# Altium schematic sheet [05] - BOTOES_LEDS.SchDoc
size A4; DocumentNumber: 5; SheetNumber: 5; SheetTotal: 5; Folha: Botões e LED's
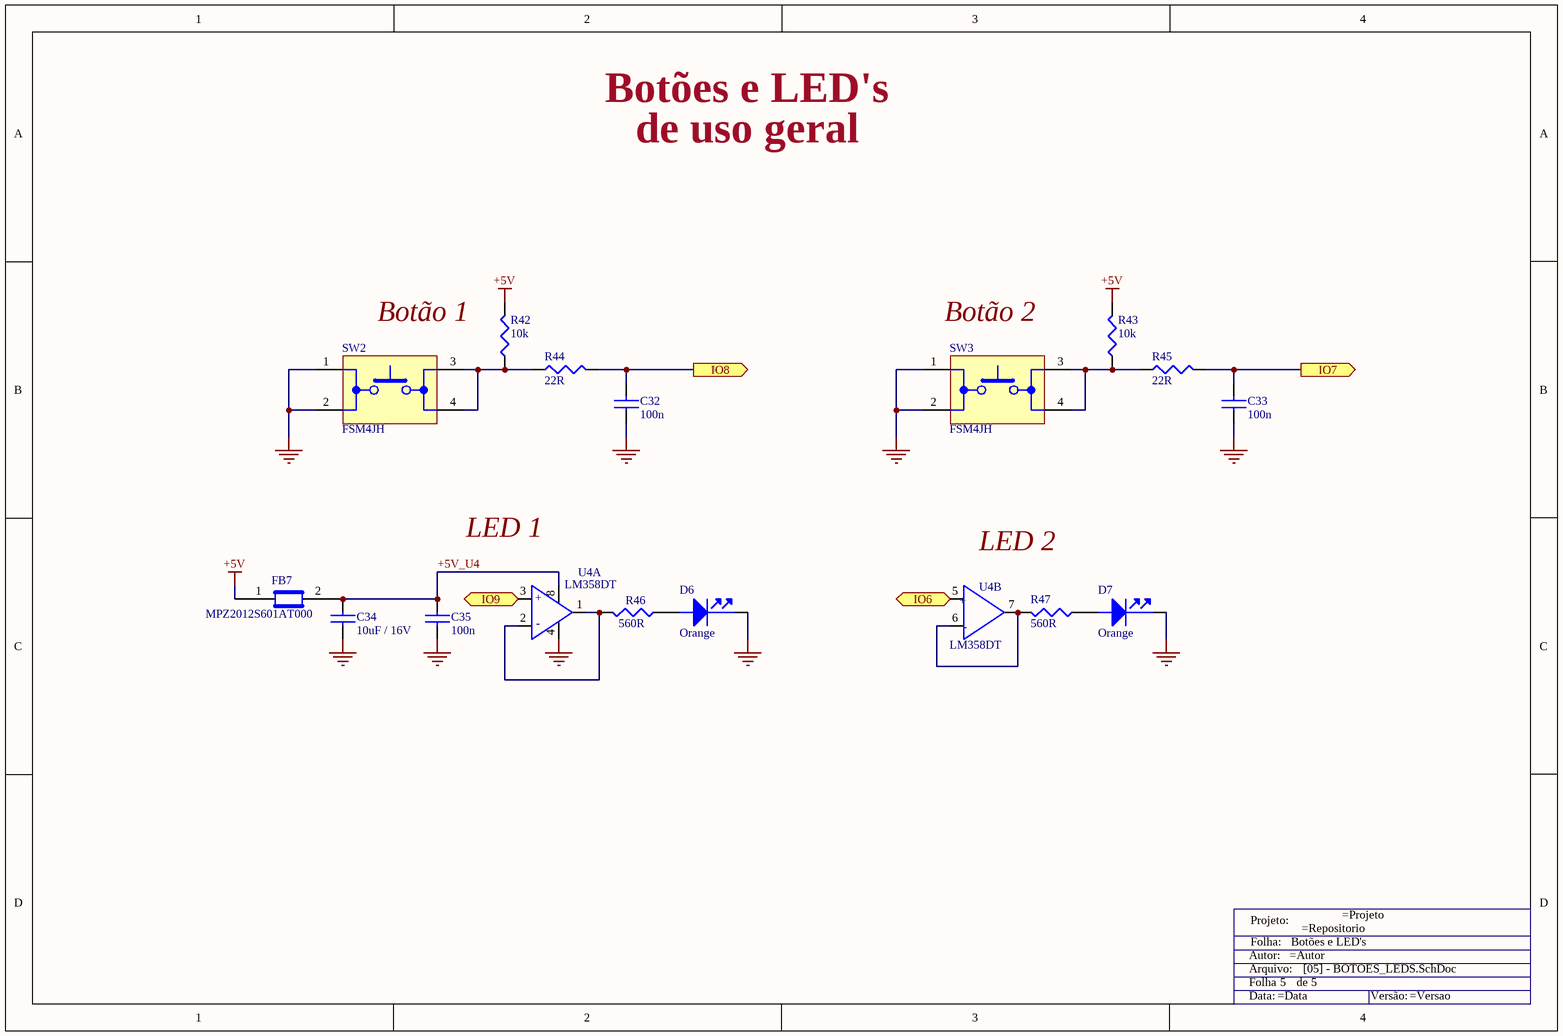
[diagram p0: [05] - BOTOES_LEDS.SchDoc]

## Parts
C32  100n  [C0805]
C33  100n  [C0805]
C34  10uF / 16V  [C0805]
C35  100n  [C0805]
D6  Orange  [LED_0603]
D7  Orange  [LED_0603]
FB7  MPZ2012S601AT000  [C0805]
R42  10k  [R0805]
R43  10k  [R0805]
R44  22R  [R0805]
R45  22R  [R0805]
R46  560R  [R0805]
R47  560R  [R0805]
SW2  FSM4JH  [FSM4JH]
SW3  FSM4JH  [FSM4JH]
TitleBlock5  Title Block  (value not drawn)  (graphical)
U4  LM358DT  [SO-8]  (parts A,B of 2)

## Ports
IO6 (in), IO7 (out), IO8 (out), IO9 (in)

## Nets
+5V: FB7.1 R42.2 R43.2
GND: C32.1 C33.1 C34.2 C35.2 D6.1(Cathode) D7.1(Cathode) SW2.1 SW2.2 SW3.1 SW3.2 U4.4(GND)
+5V_U4: C34.1 C35.1 FB7.2 U4.8(VCC)
IO6: U4.5(IN2+) ; port IO6
IO7: C33.2 R45.2 ; port IO7
IO8: C32.2 R44.2 ; port IO8
IO9: U4.3(IN1+) ; port IO9
NetD6_2: D6.2(Anode) R46.1
NetD7_2: D7.2(Anode) R47.1
NetR42_1: R42.1 R44.1 SW2.3 SW2.4
NetR43_1: R43.1 R45.1 SW3.3 SW3.4
NetR46_2: R46.2 U4.1(OUT1) U4.2(IN1-)
NetR47_2: R47.2 U4.6(IN2-) U4.7(OUT2)

## Notes on the sheet
- Botões e LED's
- de uso geral
- Botão 1
- (near SW3) Botão 2
- LED 1
- LED 2
- (in symbol LM358DT, part A) +; -
- (in symbol LM358DT, part B) +; -
- (in symbol Title Block) Projeto:; Folha:; Autor:; Arquivo:; Folha; de; Data:; Versão:

## Library data of the parts
C32 C33 C35 = C2012X7R1H104K085AA_1: CAP CER 0.1UF 50V X7R 0805; Manufacturer: TDK Corporation; Capacitance: 0.1µF; Tolerance: ±10%; Supplier 1: Digi-Key; Manufacturer Part Number: C2012X7R1H104K085AA; RoHS: RoHS Compliant; Category: Capacitors; Stock 1: 335513; Pricing 1: 1=0.1, 10=0.066, 100=0.0303, 250=0.02476, 500=0.02118, 1000=0.0165 (USD); Packaging: Cut Tape (CT); Voltage - Rated: 50V; Temperature Coefficient: X7R; Mounting Type: Surface Mount, MLCC; Operating Temperature: -55°C ~ 125°C; Applications: General Purpose; Ratings: -; Package / Case: 0805 (2012 Metric); Size / Dimension: 0.079" L x 0.049" W (2.00mm x 1.25mm); Height - Seated (Max): -; Thickness (Max): 0.037" (0.95mm); Lead Spacing: -; Features: -; Lead Style: -; ComponentLink1URL: https://product.tdk.com/info/en/catalog/datasheets/mlcc_commercial_general_en.pdf; ComponentLink1Description: https://product.tdk.com/info/en/catalog/datasheets/mlcc_commercial_general_en.pdf; Supplier Part Number 1: 445-7534-1-ND
C34 = C2012X5R1C106M125AC: CAP CER 10UF 16V X5R 0805; Manufacturer: TDK Corporation; Capacitance: 10µF; Tolerance: ±20%; Supplier 1: Digi-Key; Manufacturer Part Number: C2012X5R1C106M125AC; RoHS: RoHS Compliant; Category: Capacitors; Stock 1: 72024; Pricing 1: 1=0.33, 10=0.272, 100=0.136, 250=0.102, 500=0.0901, 1000=0.0799 (USD); Packaging: Cut Tape (CT); Voltage - Rated: 16V; Temperature Coefficient: X5R; Mounting Type: Surface Mount, MLCC; Operating Temperature: -55°C ~ 85°C; Applications: General Purpose; Ratings: -; Package / Case: 0805 (2012 Metric); Size / Dimension: 0.079" L x 0.049" W (2.00mm x 1.25mm); Height - Seated (Max): -; Thickness (Max): 0.057" (1.45mm); Lead Spacing: -; Features: -; Lead Style: -; ComponentLink1URL: https://product.tdk.com/info/en/catalog/datasheets/mlcc_commercial_general_en.pdf; ComponentLink1Description: https://product.tdk.com/info/en/catalog/datasheets/mlcc_commercial_general_en.pdf; Supplier Part Number 1: 445-4115-1-ND
D6 D7 = LO L29K-H2K1-24-Z: LED ORANGE DIFFUSED 0603 SMD; Manufacturer: OSRAM Opto Semiconductors Inc.; Lens Color: White; Millicandela Rating: 6.3mcd; Lens Style/Size: Rectangle with Flat Top, 1.30mm x 0.80mm; Voltage - Forward (Vf) (Typ): 1.8V; Current - Test: 2mA; Viewing Angle: 160°; Wavelength - Dominant: 606nm; Wavelength - Peak: 610nm; Supplier 1: Digi-Key; Manufacturer Part Number: LO L29K-H2K1-24-Z; RoHS: RoHS Compliant; Category: Optoelectronics; Stock 1: 3671; Pricing 1: 1=0.42, 10=0.299, 25=0.2456, 100=0.1964, 250=0.14728, 500=0.1339, 1000=0.10712, 2500=0.08703 (USD); Packaging: Cut Tape (CT); Color: Orange; Lens Transparency: Diffused; Mounting Type: Surface Mount; Features: -; Package / Case: 0603 (1608 Metric); Supplier Device Package: *; Size / Dimension: 1.70mm L x 0.80mm W; Height (Max): 0.65mm; ComponentLink1URL: http://www.osram-os.com/Graphics/XPic0/00077105_0.pdf; ComponentLink1Description: http://www.osram-os.com/Graphics/XPic0/00077105_0.pdf; Supplier Part Number 1: 475-2740-1-ND
FB7 = MPZ2012S601AT000: FERRITE CHIP BEAD 600 OHM SMD; Manufacturer: TDK Corporation; Impedance @ Frequency: 600 Ohm @ 100MHz; Current Rating: 2A; DC Resistance (DCR): 100 mOhm Max; Filter Type: Differential Mode - Single; Supplier 1: Digi-Key; Manufacturer Part Number: MPZ2012S601AT000; RoHS: RoHS Compliant; Category: Filters; Stock 1: 93838; Pricing 1: 1=0.12, 10=0.101, 100=0.0574, 250=0.04528, 500=0.03824, 1000=0.03221 (USD); Packaging: Cut Tape (CT); Package / Case: 0805 (2012 Metric); Mounting Type: Surface Mount; Height (Max): 0.041" (1.05mm); Size / Dimension: 0.079" L x 0.049" W (2.00mm x 1.25mm); ComponentLink1URL: https://product.tdk.com/info/en/catalog/datasheets/beads_commercial_power_mpz2012_en.pdf; ComponentLink1Description: https://product.tdk.com/info/en/catalog/datasheets/beads_commercial_power_mpz2012_en.pdf; Supplier Part Number 1: 445-2206-1-ND
R42 R43 = RC0805FR-0710KL: RES SMD 10K OHM 1% 1/8W 0805; Manufacturer: Yageo; Power (Watts): 0.125W, 1/8W; Temperature Coefficient: ±100ppm/°C; Supplier 1: Digi-Key; Manufacturer Part Number: RC0805FR-0710KL; RoHS: RoHS Compliant; Category: Resistors; Stock 1: 4526802; Pricing 1: 1=0.1, 10=0.021, 25=0.0152, 100=0.0084, 250=0.00644, 500=0.00514, 1000=0.00379, 2500=0.00329 (USD); Packaging: Cut Tape (CT); Resistance (Ohms): 10k; Tolerance: ±1%; Composition: Thick Film; Features: Moisture Resistant; Operating Temperature: -55°C ~ 155°C; Package / Case: 0805 (2012 Metric); Supplier Device Package: 0805; Size / Dimension: 0.079" L x 0.049" W (2.00mm x 1.25mm); Height: 0.024" (0.60mm); Number of Terminations: 2; ComponentLink1URL: http://www.yageo.com/NewPortal/yageodocoutput?fileName=/pdf/R-Chip/PYu-RC_Group_51_RoHS_L_3.pdf; ComponentLink1Description: http://www.yageo.com/NewPortal/yageodocoutput?fileName=/pdf/R-Chip/PYu-RC_Group_51_RoHS_L_3.pdf; Supplier Part Number 1: 311-10.0KCRCT-ND
R44 R45 = RC0805FR-0722RL: RES SMD 22 OHM 1% 1/8W 0805; Manufacturer: Yageo; Resistance (Ohms): 22; Power (Watts): 0.125W, 1/8W; Temperature Coefficient: ±100ppm/°C; Supplier 1: Digi-Key; Manufacturer Part Number: RC0805FR-0722RL; RoHS: RoHS Compliant; Category: Resistors; Stock 1: 106658; Pricing 1: 1=0.1, 10=0.021, 25=0.0152, 100=0.0084, 250=0.00644, 500=0.00514, 1000=0.00379, 2500=0.00329 (USD); Packaging: Cut Tape (CT); Tolerance: ±1%; Composition: Thick Film; Features: Moisture Resistant; Operating Temperature: -55°C ~ 155°C; Package / Case: 0805 (2012 Metric); Supplier Device Package: 0805; Size / Dimension: 0.079" L x 0.049" W (2.00mm x 1.25mm); Height: 0.024" (0.60mm); Number of Terminations: 2; ComponentLink1URL: http://www.yageo.com/NewPortal/yageodocoutput?fileName=/pdf/R-Chip/PYu-RC_Group_51_RoHS_L_3.pdf; ComponentLink1Description: http://www.yageo.com/NewPortal/yageodocoutput?fileName=/pdf/R-Chip/PYu-RC_Group_51_RoHS_L_3.pdf; Supplier Part Number 1: 311-22.0CRCT-ND
R46 R47 = RC0805FR-07560RL: RES SMD 560 OHM 1% 1/8W 0805; Manufacturer: Yageo; Resistance (Ohms): 560; Power (Watts): 0.125W, 1/8W; Temperature Coefficient: ±100ppm/°C; Supplier 1: Digi-Key; Manufacturer Part Number: RC0805FR-07560RL; RoHS: RoHS Compliant; Category: Resistors; Stock 1: 245556; Pricing 1: 1=0.1, 10=0.021, 25=0.0152, 100=0.0084, 250=0.00644, 500=0.00514, 1000=0.00379, 2500=0.00329 (USD); Packaging: Cut Tape (CT); Tolerance: ±1%; Composition: Thick Film; Features: Moisture Resistant; Operating Temperature: -55°C ~ 155°C; Package / Case: 0805 (2012 Metric); Supplier Device Package: 0805; Size / Dimension: 0.079" L x 0.049" W (2.00mm x 1.25mm); Height: 0.024" (0.60mm); Number of Terminations: 2; ComponentLink1URL: http://www.yageo.com/NewPortal/yageodocoutput?fileName=/pdf/R-Chip/PYu-RC_Group_51_RoHS_L_3.pdf; ComponentLink1Description: http://www.yageo.com/NewPortal/yageodocoutput?fileName=/pdf/R-Chip/PYu-RC_Group_51_RoHS_L_3.pdf; Supplier Part Number 1: 311-560CRCT-ND
SW2 SW3 = FSM4JH: Tactile Switches SPST OFF-(ON) Round pushbutton; Manufacturer: TE Connectivity / Alcoswitch; Current Rating: 50 mA; Operating Force: 1.6 N; Voltage Rating DC: 12 VDC; Ground Terminal: No; Mounting Direction: Vertical; Supplier 1: Mouser; Manufacturer Part Number: FSM4JH; RoHS: RoHS Compliant; Category: Tactile Switches; Stock 1: 42422; Pricing 1: 1=0.100, 25=0.075, 50=0.069, 100=0.066, 250=0.063, 500=0.058, 1000=0.054, 2000=0.051, 5000=0.050 (USD); Actuator: Round; Contact Form: SPST; Packaging: Bulk; Switch Function: OFF - (ON); Termination Style: Solder Pin; Brand: TE Connectivity / Alcoswitch; Mounting Style: Through Hole; Standard Pack Qty: 750; RoHS - Mouser: Y; Minimum Order Quantity: 1; Reeling: False; ComponentLink1URL: http://www.mouser.com/ds/2/418/NG_CD_1825910_C9-679020.pdf; ComponentLink1Description: http://www.mouser.com/ds/2/418/NG_CD_1825910_C9-679020.pdf; Supplier Part Number 1: 506-FSM4JH
U4 = LM358DT: Operational Amplifiers - Op Amps Dual Low Power; Manufacturer: STMicroelectronics; Amplifier Type: Low Power Amplifier; Supply Type: Single, Dual; Number of Channels: 2 Channel; Shutdown: No Shutdown; CMRR - Common Mode Rejection Ratio: 70 dB; Dual Supply Voltage: +/- 3 V, +/- 5 V, +/- 9 V, +/- 12 V; en - Input Voltage Noise Density: 55 nV/sqrt Hz; GBP - Gain Bandwidth Product: 1.1 MHz; Ib - Input Bias Current: 150 nA; Maximum Dual Supply Voltage: +/- 15 V; Minimum Dual Supply Voltage: +/- 1.5 V; Operating Supply Current: 1.2 mA; Operating Supply Voltage: 3 V to 30 V, +/- 1.5 V to +/- 15 V; Output Current per Channel: 40 mA; Pd - Power Dissipation: 500 mW (1/2 W); PSRR - Power Supply Rejection Ratio: 65 dB; SR - Slew Rate: 0.6 V/us; Supply Voltage - Max: 30 V; Supply Voltage - Min: 3 V; Voltage Gain dB: 100 dB; Vos - Input Offset Voltage: 7 mV; Supplier 1: Mouser; Manufacturer Part Number: LM358DT; RoHS: RoHS Compliant; Category: Operational Amplifiers - Op Amps; Stock 1: 34702; Pricing 1: 1=0.420, 10=0.295, 100=0.136, 1000=0.104, 2500=0.089, 10000=0.081, 25000=0.076, 50000=0.068, 100000=0.065 (USD); Height: 1.65 mm (Max); Length: 5 mm (Max); Package / Case: SO-8; Packaging: Cut Tape; Product: Operational Amplifiers; Series: LM358; Technology: Bipolar; Width: 4 mm (Max); Brand: STMicroelectronics; Mounting Style: SMD/SMT; Maximum Operating Temperature: + 70 C; Minimum Operating Temperature: 0 C; Standard Pack Qty: 2500; RoHS - Mouser: Y; Minimum Order Quantity: 1; Reeling: True; ComponentLink1URL: http://www.mouser.com/ds/2/389/lm158-954927.pdf; ComponentLink1Description: http://www.mouser.com/ds/2/389/lm158-954927.pdf; Supplier Part Number 1: 511-LM358DT